# EAGLE design gems (EAGLE 9.6.0)
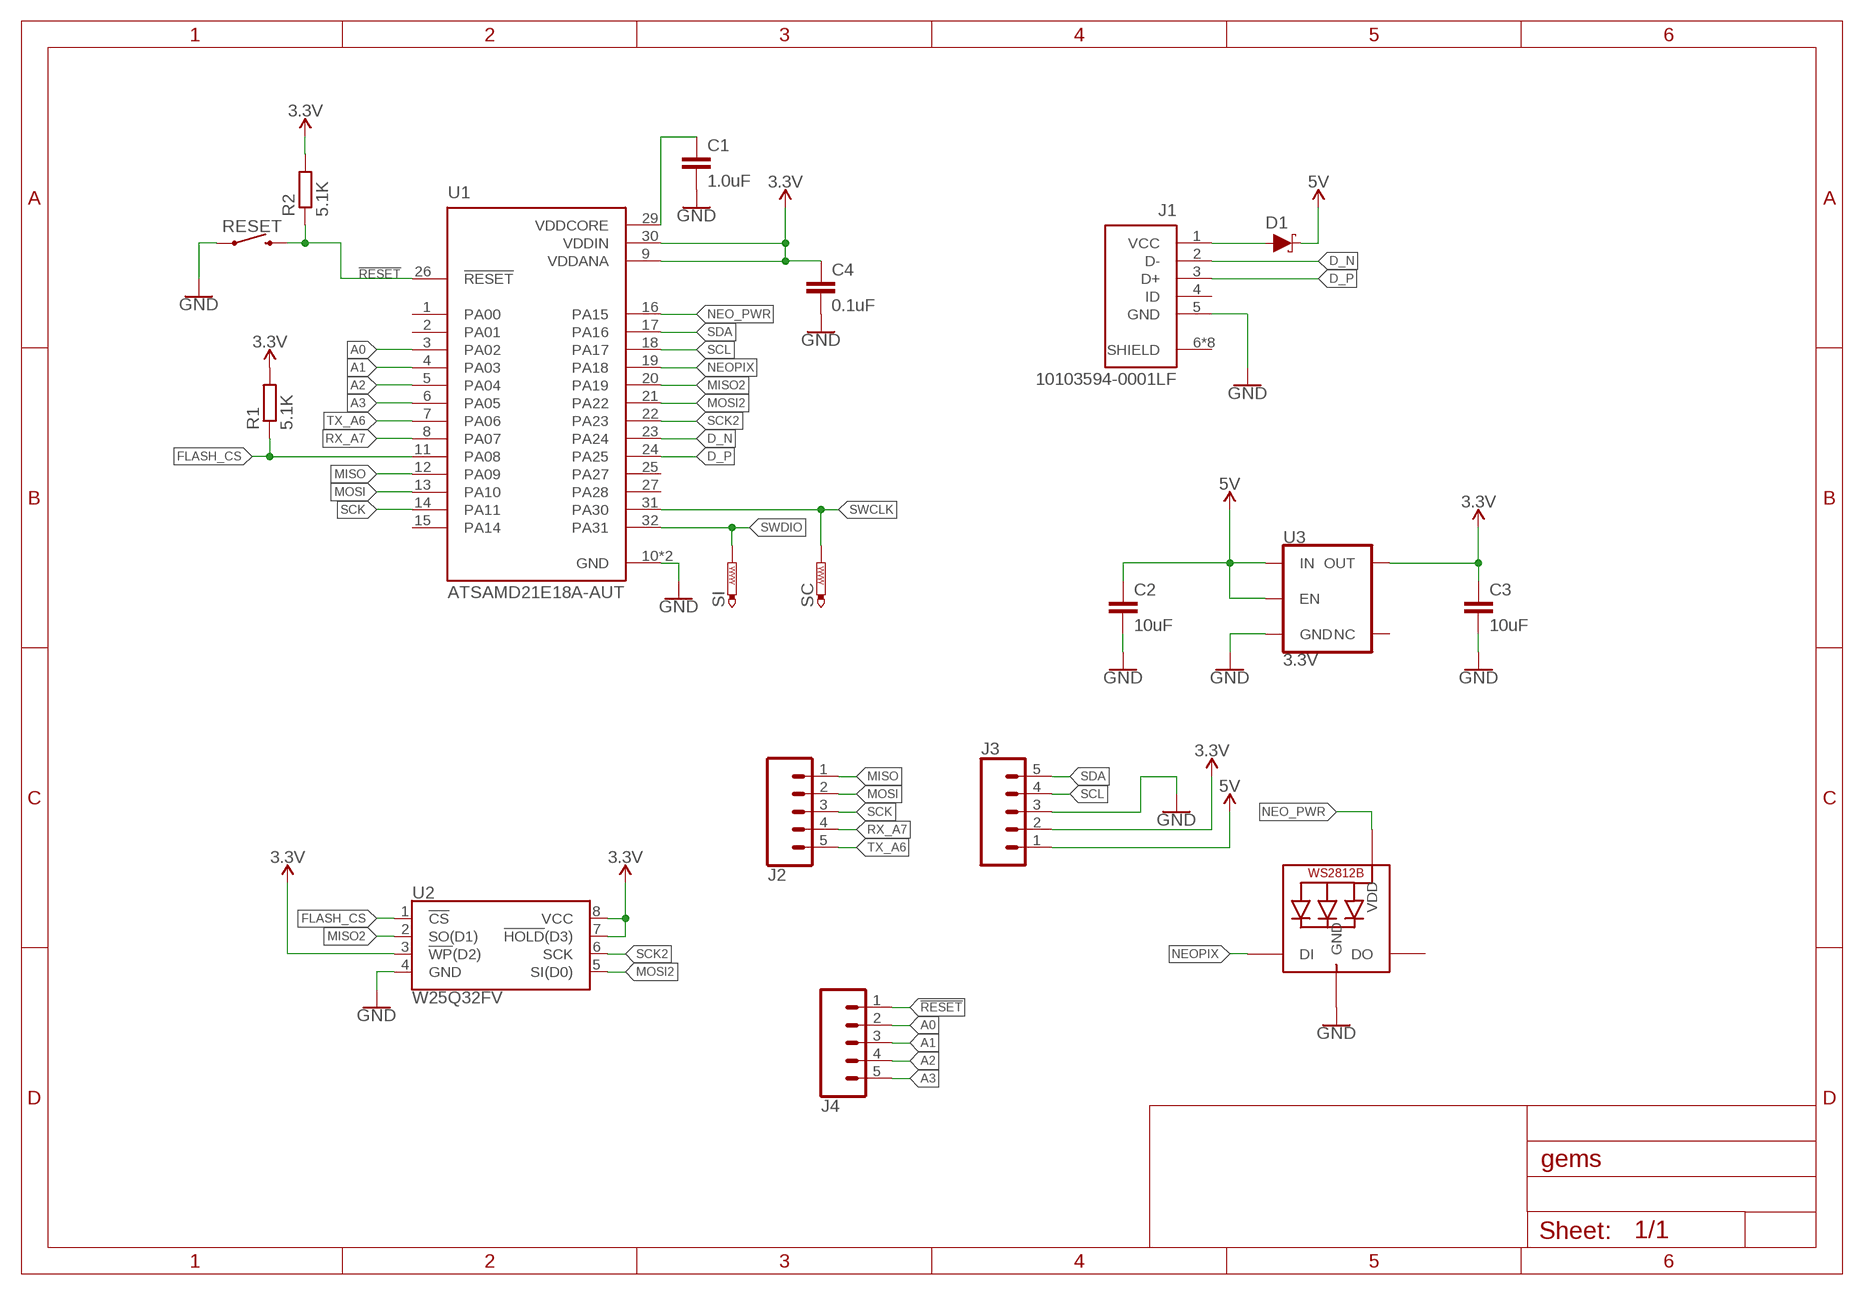
[diagram p0: schematic, sheet 1]

## Parts
C1  1.0uF  1.0UF-0402-16V-10%  [0402]
C2  10uF  10UF-0603-6.3V-20%  [0603]
C3  10uF  10UF-0603-6.3V-20%  [0603]
C4  0.1uF  0.1UF-0402-16V-10%  [0402]
D1  0.5A/40V/420mV  DIODE-SCHOTTKY-PMEG4005EJ  [SOD-323]
J1  10103594-0001LF  [AMPHENOL_10103594-0001LF]
J2  CONN_05  [1X05]
J3  CONN_05  [1X05]
J4  CONN_05  [1X05]
LED  WS2812B_SK6805_1515  [SK6805_1515]
R1  5.1K  R-EU_R0402  [R0402]
R2  5.1K  R-EU_R0402  [R0402]
RESET  MOMENTARY-SWITCH-SPST-SMD-4.6X2.8MM  [TACTILE_SWITCH_SMD_4.6X2.8MM]
SC  PTR1TP08R  [TP08R]
SI  PTR1TP08R  [TP08R]
U1  ATSAMD21E18A-AUT  [QFP80P900X900X120-32N]
U2  W25Q32FV  W25Q32FVSS  [SOIC-8]
U3  3.3V  V_REG_AP2112K-3.3V  [SOT23-5]

## Nets
3.3V: C3.1 C4.1 J3.2 R1.2 R2.2 U1.9(VDDANA) U1.30(VDDIN) U2.3(!WP!(D2)) U2.7(!HOLD!(D3)) U2.8(VCC) U3.5(OUT)
5V: C2.1 D1.C J3.1 U3.1(IN) U3.3(EN)
!RESET!: J4.1 R2.1 RESET.3 RESET.4 U1.26(!RESET)
A0: J4.2 U1.3(PA02)
A1: J4.3 U1.4(PA03)
A2: J4.4 U1.5(PA04)
A3: J4.5 U1.6(PA05)
D_N: J1.2(D-) U1.23(PA24)
D_P: J1.3(D+) U1.24(PA25)
FLASH_CS: R1.1 U1.11(PA08) U2.1(!CS!)
GND: C1.2 C2.2 C3.2 C4.2 J1.5(GND) J3.3 LED.4(GND) RESET.1 RESET.2 U1.10(GND) U1.28(GND) U2.4(GND) U3.2(GND)
MISO: J2.1 U1.12(PA09)
MISO2: U1.20(PA19) U2.2(SO(D1))
MOSI: J2.2 U1.13(PA10)
MOSI2: U1.21(PA22) U2.5(SI(D0))
N$1: C1.1 U1.29(VDDCORE)
N$2: D1.A J1.1(VCC)
NEO_PWR: LED.2(VDD) U1.16(PA15)
NEOPIX: LED.1(DI) U1.19(PA18)
RX_A7: J2.4 U1.8(PA07)
SCK: J2.3 U1.14(PA11)
SCK2: U1.22(PA23) U2.6(SCK)
SCL: J3.4 U1.18(PA17)
SDA: J3.5 U1.17(PA16)
SWCLK: SC.TP U1.31(PA30)
SWDIO: SI.TP U1.32(PA31)
TX_A6: J2.5 U1.7(PA06)
Unconnected: J1.4(ID) J1.6(SHIELD) J1.7(SHIELD) J1.8(SHIELD) J1.9(SHIELD) J1.10(SHIELD) J1.11(SHIELD) J1.S1(SHIELD) J1.S2(SHIELD) LED.3(DO) U1.1(PA00) U1.2(PA01) U1.15(PA14) U1.25(PA27) U1.27(PA28) U3.4(NC)

## Library data of the parts
C1 = SparkFun-Capacitors:1.0UF: 1µF ceramic capacitors A capacitor is a passive two-terminal electrical component used to store electrical energy temporarily in an electric field.; PROD_ID: CAP-12417
C2 C3 = SparkFun-Capacitors:10UF: 10.0µF ceramic capacitors A capacitor is a passive two-terminal electrical component used to store electrical energy temporarily in an electric field.; PROD_ID: CAP-11015
C4 = SparkFun-Capacitors:0.1UF: 0.1µF ceramic capacitors A capacitor is a passive two-terminal electrical component used to store electrical energy temporarily in an electric field.; PROD_ID: CAP-12416
D1 = SparkFun-DiscreteSemi:DIODE-SCHOTTKY: Schottky diode A Schottky diode is a semiconductor diode which has a low forward voltage drop and a very fast switching action.; PROD_ID: DIO-10955
J1 = 10103594-0001LF:10103594-0001LF: USB - micro B USB 2.0 Receptacle Connector 5 Position Surface Mount, Right Angle; Through Hole Check prices <https://pricing.snapeda.com/parts/10103594-0001LF/Amphenol%20ICC%20%28FCI%29/view-part?ref=eda>; AVAILABILITY: Good; DESCRIPTION: USB - micro B USB 2.0 Receptacle Connector 5 Position Surface Mount, Right Angle; Through Hole; MF: Amphenol ICC (FCI); MP: 10103594-0001LF; PACKAGE: None; PRICE: None; PURCHASE-URL: https://pricing.snapeda.com/search/part/10103594-0001LF/?ref=eda
J2-J4 = SparkFun-Connectors:CONN_05: Multi connection point. Often used as Generic Header-pin footprint for 0.1 inch spaced/style header connections On any of the 0.1 inch spaced packages, you can populate with these: Break Away Headers - Straight <https://www.sparkfun.com/products/116> (PRT-00116) Break Away Male Headers - Right Angle <https://www.sparkfun.com/products/553> (PRT-00553) Female Headers <https://www.sparkfun.com/products/115> (PRT-00115) Break Away Headers - Machine Pin <https://www.sparkfun.com/products/117> (PRT-00117) Break Away Female Headers - Swiss Machine Pin <https://www.sparkfun.com/products/743> (PRT-00743) For SCREWTERMINALS and SPRING TERMINALS visit here: Screw Terimnals on SparkFun.com <https://www.sparkfun.com/search/results?term=Screw+Terminals> (5mm/3.5mm/2.54mm spacing) This device is also useful as a general connection point to wire up your design to another part of your project. Our various solder wires solder well into these plated through hole pads. Hook-Up Wire - Assortment (Stranded, 22 AWG) <https://www.sparkfun.com/products/11375> (PRT-11375) Hook-Up Wire - Assortment (Solid Core, 22 AWG) <https://www.sparkfun.com/products/11367> (PRT-11367) View the entire wire category on our website here <https://www.sparkfun.com/categories/141> Special notes: Molex polarized connector foot print use with SKU : PRT-08231 with associated crimp pins and housings. 1MM SMD Version SKU: PRT-10208
LED = microbuilder:WS2812B
R1 R2 = rcl:R-EU_: RESISTOR, European symbol; SPICEPREFIX: R
RESET = SparkFun-Switches:MOMENTARY-SWITCH-SPST: Momentary Switch (Pushbutton) - SPST Normally-open (NO) SPST momentary switches (buttons, pushbuttons). Variants PTH-12MM - 12mm square, through-hole Momentary Pushbutton Switch - 12mm Square <https://www.sparkfun.com/products/9190> (COM-09190) PTH-6.0MM, PTH-6.0MM-KIT - 6.0mm square, through-hole Mini Pushbutton Switch <https://www.sparkfun.com/products/97> (COM-00097) KIT package intended for soldering kit's - only one side of pads' copper is exposed. PTH-RIGHT-ANGLE-KIT - Right-angle, through-hole Right Angle Tactile Button <https://www.sparkfun.com/products/10791> - Used on SparkFun BigTime Watch Kit <https://www.sparkfun.com/products/11734> SMD-12MM - 12mm square, surface-mount Tactile Button - SMD (12mm) <https://www.sparkfun.com/products/12993> (COM-12993) Used on SparkFun PicoBoard <https://www.sparkfun.com/products/11888> SMD-4.5MM - 4.5mm Square Trackball Switch Used on SparkFun Blackberry Trackballer Breakout <https://www.sparkfun.com/products/13169> SMD-4.6MMX2.8MM - 4.60mm x 2.80mm, surface mount Used on SparkFun SAMD21 Mini Breakout <https://www.sparkfun.com/products/13664> SMD-5.2MM, SMD-5.2-REDUNDANT - 5.2mm square, surface-mount Mini Pushbutton Switch - SMD <https://www.sparkfun.com/products/8720> (COM-08720) Used on Arduino Pro Mini <https://www.sparkfun.com/products/11114> REDUNDANT package connects both switch circuits together SMD-6.0X3.5MM - 6.0 x 3.5mm, surface mount Momentary Reset Switch SMD <https://www.sparkfun.com/products/8229> (COM-08229) SMD-6.2MM-TALL - 6.2mm square, surface mount Tactile Button - SMD (6mm) <https://www.sparkfun.com/products/12992> Used on SparkFun Digital Sandbox <https://www.sparkfun.com/products/12651> SMD-RIGHT-ANGLE - Right-angle, surface mount Used on SparkFun Block for Intel® Edison - Arduino <https://www.sparkfun.com/products/13036>; PROD_ID: SWCH-13065
SC SI = testpad:PTR1: TEST PIN
U1 = ATSAMD21E18A-AUT:ATSAMD21E18A-AUT: ARM Cortex-M0+ SAM D21E Microcontroller IC 32-Bit 48MHz 256KB (256K x 8) FLASH 32-TQFP (7x7) Check prices <https://pricing.snapeda.com/parts/ATSAMD21E18A-AUT/Microchip/view-part?ref=eda>; AVAILABILITY: Good; DESCRIPTION: ARM® Cortex®-M0+ SAM D21E, Functional Safety (FuSa) Microcontroller IC 32-Bit 48MHz 256KB (256K x 8) FLASH; MF: Microchip; MP: ATSAMD21E18A-AUT; PACKAGE: TQFP-32 Microchip; PRICE: None; PURCHASE-URL: https://pricing.snapeda.com/search/part/ATSAMD21E18A-AUT/?ref=eda
U2 = SparkFun-IC-Memory:W25Q32FV: W25Q32FV 32Mb (4MB) Serial Flash Memory The W25Q32FV support the standard Serial Peripheral Interface (SPI), Dual/Quad I/O SPI as well as 2-clocks instruction cycle Quad Peripheral Interface (QPI). 104MHz, SPI, 8-SOIC-EIAJ Datasheet <http://www.winbond.com/resource-files/w25q32fv%20revh%20091613.pdf> SparkFun Products SparkFun Blynk Board - ESP8266 <https://www.sparkfun.com/products/13794> (WRL-13794); PROD_ID: IC-13229
U3 = SparkFun-IC-Power:V_REG_AP2112: AP2112 - 600mA CMOS LDO Regulator w/ Enable The AP2112 is CMOS process low dropout linear regulator with enable function, the regulator delivers a guaranteed 600mA (min.) continuous load current. Features Output Voltage Accuracy: ±1.5% Output Current: 600mA (Min.) Foldback Short Current Protection: 50mA Enable Function to Turn ON/OFF VOUT Low Dropout Voltage (3.3V): 250mV (Typ.) @IOUT=600mA Excellent Load Regulation: 0.2%/A (Typ.) Excellent Line Regulation: 0.02%/V (Typ.) Low Quiescent Current: 55μA (Typ.) Low Standby Current: 0.01μA (Typ.) Low Output Noise: 50μVRMS PSRR: 100Hz -65dB, 1kHz -65dB OTSD Protection Stable with 1.0μF Flexible Cap: Ceramic, Tantalum and Aluminum Electrolytic Operation Temperature Range: -40°C to 85°C ESD: MM 400V, HBM 4000V; PROD_ID: VREG-12457

## Board
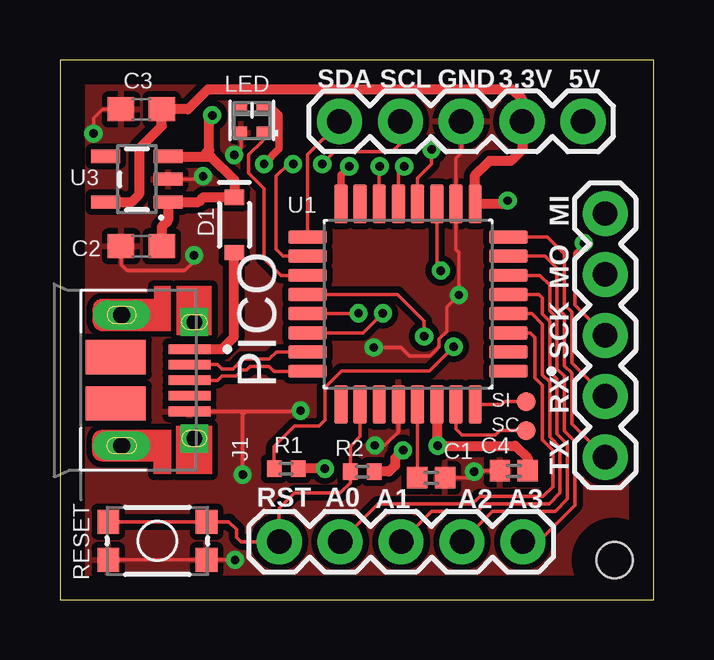
[diagram p1: board, top side]
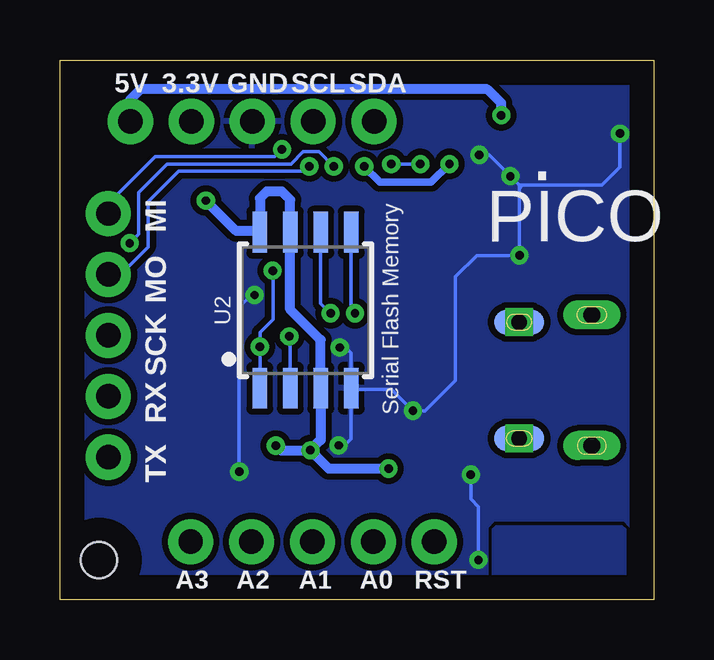
[diagram p2: board, bottom side, seen from below]

Size 24.75 x 22.5 mm. Coordinates in mm from the lower left corner, seen from the top.
Outline: 0,0 24.75,0 24.75,22.5 0,22.5 0,0
Copper layers (1*16): Top 0.035mm / dielectric 1.5mm / Bottom 0.035mm
Design rules "default *": minimum track width 6mil, minimum drill 0.35mm, track to track 6mil, track to pad 6mil, pad to pad 6mil, via to via 6mil, smd to smd 6mil, copper to edge 40mil, drill to drill 6mil, minimum pad ring 10mil, minimum via ring 8mil, stop-mask expansion 4mil, vias tented up to drill 15mil, thermal gap 10mil
Holes 1.5 mm at 23.12,1.65

### Footprints (pad centres in the part's own frame; a part is rotated, then mirrored left to right if it is on the bottom)
0402 = smd 0.85 x 0.9: 1 -0.58,0; 2 0.58,0
0603 = smd 1.1 x 1: 1 -0.85,0; 2 0.85,0
SOD-323 = smd 0.63 x 0.83: A 1.15,0; C -1.15,0
AMPHENOL_10103594-0001LF = smd 0.4 x 1.75: 1 -1.3,2.825; 2 -0.65,2.825; 3 0,2.825; 4 0.65,2.825; 5 1.3,2.825 | drill 0.65 pad 0.73 square: 6 -2.425,3.03; 7 2.425,3.03 | drill 0.7 pad 1.2 long: 8 -2.725,0; 9 2.725,0 | smd 1.05 x 2.1 bottom: 10 -2.425,3.03; 11 2.425,3.03 | smd 1.425 x 2.5: S1 -0.963,-0.25; S2 0.963,-0.25
1X05 = drill 1.016 pad 1.88: 1 0,0; 2 2.54,0; 3 5.08,0; 4 7.62,0; 5 10.16,0
SK6805_1515 = smd 0.5 x 0.5: 1 -0.5,-0.45; 2 0.5,-0.45; 3 0.5,0.45; 4 -0.5,0.45
R0402 = smd 0.6 x 0.7: 1 -0.5,0; 2 0.5,0
TACTILE_SWITCH_SMD_4.6X2.8MM = smd 0.9 x 1: 1 -2.05,-0.8; 2 2.05,-0.8; 3 2.05,0.8; 4 -2.05,0.8
TP08R = smd 0.8 x 0.8: TP 0,0
QFP80P900X900X120-32N = smd 1.6 x 0.55: 1 -4.18,2.8; 2 -4.18,2; 3 -4.18,1.2; 4 -4.18,0.4; 5 -4.18,-0.4; 6 -4.18,-1.2; 7 -4.18,-2; 8 -4.18,-2.8; 17 4.18,-2.8; 18 4.18,-2; 19 4.18,-1.2; 20 4.18,-0.4; 21 4.18,0.4; 22 4.18,1.2; 23 4.18,2; 24 4.18,2.8 | smd 0.55 x 1.6: 9 -2.8,-4.18; 10 -2,-4.18; 11 -1.2,-4.18; 12 -0.4,-4.18; 13 0.4,-4.18; 14 1.2,-4.18; 15 2,-4.18; 16 2.8,-4.18; 25 2.8,4.18; 26 2,4.18; 27 1.2,4.18; 28 0.4,4.18; 29 -0.4,4.18; 30 -1.2,4.18; 31 -2,4.18; 32 -2.8,4.18
SOIC-8 = smd 0.61 x 1.702: 1 -1.905,-3.251; 2 -0.635,-3.251; 3 0.635,-3.251; 4 1.905,-3.251; 5 1.905,3.251; 6 0.635,3.251; 7 -0.635,3.251; 8 -1.905,3.251
SOT23-5 = smd 0.55 x 1.2: 1 -0.95,-1.3; 2 0,-1.3; 3 0.95,-1.3; 4 0.95,1.3; 5 -0.95,1.3

### Placement (x,y rotation side)
C1  15.48,5.08 0 top
C2  3.4,14.73 180 top
C3  3.4,20.45 180 top
C4  18.92,5.37 180 top
D1  7.27,15.62 270 top
J1  2.57,9.14 270 top
J2  22.73,16.1 270 top
J3  21.81,19.94 180 top
J4  9.14,2.41 0 top
LED  8,19.97 90 top
R1  9.43,5.46 0 top
R2  12.61,5.33 0 top
RESET  4.06,2.45 0 top
SC  19.43,7.05 0 top
SI  19.43,8.26 0 top
U1  14.51,12.32 180 top
U2  14.51,12.06 0 bottom
U3  3.21,17.53 90 top

### Tracks (layer width: path | path; a pad name or v marks a point on that pad's centre or on a via)
3.3V  (via drill 0.35)
  Top 0.406: U1.30 15.71,6.45 v15.75,6.41 18.99,6.41 19.5,5.9 C4.1 | v18.67,16.64 18.53,16.5 U1.9 17.31,17.69 17.91,18.29 18.8,18.29 19.27,18.76 J3.2 19.27,20.86 18.85,21.28 6.17,21.28 5.33,20.45 C3.1 4.25,19.74 3.3,18.8 3.3,16.89 2.99,16.58 U3.5 | v11.05,5.46 R1.2 | v14.3,6.22 13.97,5.89 13.97,5.59 13.72,5.33 R2.2
  Bottom 0.406: v18.67,16.64 17.4,15.37 16.47,15.37 U2.8 16.42,16.73 16.13,17.02 15.49,17.02 15.15,16.67 U2.7 15.15,12.1 13.88,10.83 U2.3 13.88,6.65 v14.3,6.22 | v15.75,6.41 15.56,6.22 v14.3,6.22 | v14.3,6.22 13.54,5.46 v11.05,5.46
5V  (via drill 0.35)
  Top 0.406: C2.1 4.25,15.55 4.51,15.81 U3.1 5.78,16.58 5.98,16.77 D1.C 7.27,17.49 6.29,18.48 6.22,18.48 | U3.3 5.97,18.48 | 5.97,18.48 6.22,18.48 | v6.35,20.19 6.22,20.07 6.22,18.73 | 6.22,18.48 6.22,18.73 | 6.22,18.73 5.97,18.48
  Bottom 0.406: v6.35,20.19 6.35,20.7 6.93,21.28 21.39,21.28 21.81,20.86 J3.1
!RESET!
  Top 0.152: U1.26 12.51,6.8 12.11,6.39 R2.1 12.11,4.87 11.68,4.45 9.78,4.45 9.14,3.81 J4.1 7.56,2.41 7.37,2.6 7.37,2.92 7.04,3.25 RESET.3 RESET.4
A0
  Top 0.152: J4.2 13.26,3.99 17.2,3.99 17.5,4.29 20.14,4.29 20.55,4.7 20.55,6.22 20.12,6.66 20.12,8.94 19.81,9.24 19.81,10.92 19.61,11.12 U1.3
A1
  Top 0.152: U1.4 19.68,11.92 20.12,11.48 20.12,9.37 20.42,9.06 20.42,6.78 20.85,6.35 20.85,4.45 20.4,3.99 17.7,3.99 17.4,3.68 15.49,3.68 J4.3
A2
  Top 0.152: J4.4 18.03,3.68 20.65,3.68 21.16,4.19 21.16,6.48 20.73,6.91 20.73,9.19 20.42,9.49 20.42,11.6 20.12,11.91 20.12,12.57 19.97,12.72 U1.5
A3
  Top 0.152: U1.6 20.01,13.52 20.42,13.11 20.42,12.03 20.73,11.73 20.73,9.62 21.03,9.32 21.03,7.04 21.46,6.6 21.46,3.94 19.94,2.41 J4.5
D_N
  Top 0.152: J1.2 6.58,9.79 6.75,9.62 7.21,9.62 7.61,10.02 8.73,10.02 9.02,10.32 U1.23
D_P
  Top 0.152: J1.3 6.58,9.14 6.75,9.32 7.33,9.32 7.58,9.56 7.78,9.56 7.94,9.72 8.73,9.72 8.93,9.52 U1.24
FLASH_CS  (via drill 0.35)
  Top 0.152: v15.88,13.72 15.71,13.88 U1.11 | R1.1 8.93,6.39 9.78,7.24 10.79,7.24 11.05,7.49 11.05,8.84 11.74,9.53 15.4,9.53 v16.42,10.54
  Bottom 0.152: U2.1 v16.42,10.54 16.42,11.14 15.88,11.68 v15.88,13.71 v15.88,13.72
GND  (via drill 0.35)
  Top 0.152: v7.27,18.54 7.55,18.83 LED.4 | U1.28 14.11,7 13.54,6.43 v13.13,6.43 | J1.5 7.49,7.84 | 7.49,7.84 7.62,7.84 | 7.62,7.84 7.75,7.84 | 7.75,7.84 10,7.84 v10.03,7.87 | RESET.1 RESET.2 v7.3,1.65 | 7.62,7.84 7.62,7.75 | 7.62,7.75 7.59,7.75 7.49,7.84 | 7.62,7.75 7.65,7.75 7.75,7.84 | C2.2 2.55,13.98 2.81,13.72 5.21,13.72 5.59,14.1 v5.59,14.35 | C3.2 1.78,20.45 1.4,20.07 v1.4,19.43 | v13.08,10.51 14.22,10.51 14.58,10.16 15.43,10.16 15.81,10.54 15.81,10.86 16.13,11.18 16.13,12.19 v16.64,12.7 16.64,14.48 16.51,14.6 U1.10 16.51,18.42 16.73,18.64 J3.3 | C1.2 17.02,5.08 v17.27,5.33 17.3,5.37 C4.2 | v7.62,5.21 7.62,7.75 | v5.97,17.65 5.84,17.53 U3.2
  Bottom 0.152: v13.13,6.43 12.88,6.43 12.61,6.7 12.61,8.76 | 12.61,8.76 U2.4 12.61,10.29 12.83,10.51 v13.08,10.51 | 12.61,8.76 10.92,8.76 v10.03,7.87 9.53,7.87 8.26,9.14 8.26,13.46 7.37,14.35 v5.59,14.35 5.59,17.14 | v17.27,5.33 17.27,12.19 16.76,12.7 v16.64,12.7 | 5.59,17.14 5.59,17.27 | 5.59,17.27 v5.97,17.65 6.86,18.54 v7.27,18.54 | 5.46,17.27 2.16,17.27 1.4,18.03 v1.4,19.43 | 5.46,17.27 5.59,17.27 | 5.46,17.27 5.59,17.14 | v7.3,1.65 7.3,3.87 7.62,4.19 v7.62,5.21
  pour Bottom (isolate 0.254): 0,0 4.06,0 4.06,0.79 0.97,0.79 0.97,3 1.22,3.25 6.65,3.25 6.91,3 6.91,0.79 4.11,0.79 4.11,0 24.77,0 24.77,22.48 0,22.48
  pour Top (isolate 0.254): 0,0 24.74,0 24.74,22.5 0,22.5
MISO  (via drill 0.35)
  Top 0.152: U1.12 14.91,17.58 15.49,18.16 v15.49,18.77
  Bottom 0.152: v15.49,18.77 15.8,18.47 20.78,18.47 22.73,16.51 J2.1
MISO2  (via drill 0.35)
  Top 0.152: v15.19,10.97 15.19,11.61 14.08,12.72 U1.20
  Bottom 0.152: v15.19,10.97 15.15,10.93 U2.2
MOSI  (via drill 0.35)
  Top 0.152: U1.13 14.11,17.82 v14.35,18.06
  Bottom 0.152: v14.35,18.06 14.56,17.86 19.81,17.86 21.08,16.59 21.08,14.7 22.23,13.56 J2.2
MOSI2  (via drill 0.35)
  Top 0.152: v12.45,11.94 12.43,11.92 U1.21
  Bottom 0.152: U2.5 12.61,12.1 v12.45,11.94
N$1
  Top 0.152: U1.29 C1.1
N$2
  Top 0.406: J1.1 6.76,10.44 7.24,10.92 7.24,14.44 D1.A
NEO_PWR  (via drill 0.35)
  Top 0.305: U1.16 11.71,17.71 v12.06,18.06 | v8.51,18.16 9.14,18.8 9.14,20.19 8.87,20.47 LED.2
  Bottom 0.305: v12.06,18.06 11.4,17.4 9.27,17.4 v8.51,18.16
NEOPIX
  Top 0.152: U1.19 9.21,13.52 8.51,14.22 8.51,17.14 7.87,17.78 7.87,18.54 8.45,19.12 LED.1
RX_A7
  Top 0.152: U1.8 20.31,15.12 21.03,14.4 21.03,12.29 21.34,11.98 21.34,9.87 J2.4
SCK  (via drill 0.35)
  Top 0.152: U1.14 13.31,18.04 v13.34,18.06 | v21.84,14.86 21.46,14.48 21.46,12.29 J2.3
  Bottom 0.152: v13.34,18.06 13.94,18.67 14.61,18.67 15.11,18.16 20.27,18.16 21.46,16.97 21.46,15.24 v21.84,14.86
SCK2  (via drill 0.35)
  Top 0.152: v13.46,11.94 12.64,11.12 U1.22
  Bottom 0.152: v13.46,11.94 13.88,12.35 U2.6
SCL  (via drill 0.35)
  Top 0.152: U1.18 9.3,14.32 9.02,14.61 9.02,17.65 9.53,18.16 v9.72,18.16 | v10.94,18.16 11.45,18.67 13.84,18.67 14.19,19.02 J3.4
  Bottom 0.152: v9.72,18.16 v10.94,18.16
SDA
  Top 0.152: U1.17 10.33,18.54 11.65,19.86 J3.5
SWCLK
  Top 0.152: U1.31 16.51,7.11 16.76,6.86 18.16,6.86 18.35,7.05 SC.TP
SWDIO
  Top 0.152: SI.TP 18.54,8.26 18.43,8.14 U1.32
TX_A6
  Top 0.152: U1.7 20.23,14.32 20.73,13.82 20.73,12.16 21.03,11.86 21.03,9.75 21.34,9.44 21.34,7.33 J2.5
XYX
  pour Bottom: 6.73,2.92 6.73,0.97 1.14,0.97 1.14,2.92 1.3,3.07 6.58,3.07

### Text on the board
tPlace: SDA | SCL | GND | 3.3V | 5V | . | MI | MO | SCK | PICO | RX | TX | RST | A0 | A1 | A2 | A3
bPlace: SDA | SCL | GND | 3.3V | 5V | . | Serial Flash Memory | MI | PICO | MO | SCK | RX | TX | RST | A0 | A1 | A2 | A3
bStop: Designed by / AP and NRB